# EasyEDA Pro project 第十五届蓝桥杯EDA赛项模拟试题一（嘉立创EDA提供）.eprj

# Schematic Schematic1
Board Name: Board1; Create Date: 2024-01-25; Page Name: P1; Project Name: 第十五届蓝桥杯EDA赛项模拟试题一（嘉立创EDA提供）; Schematic Name: Schematic1; Update Date: 2024-10-25; Company: 深圳嘉立创科技集团股份有限公司; Drawed: 嘉立创EDA; Page Size: A4; Part Number: JLC-PCB-002; Reviewed: 嘉立创EDA; Version: V1.0
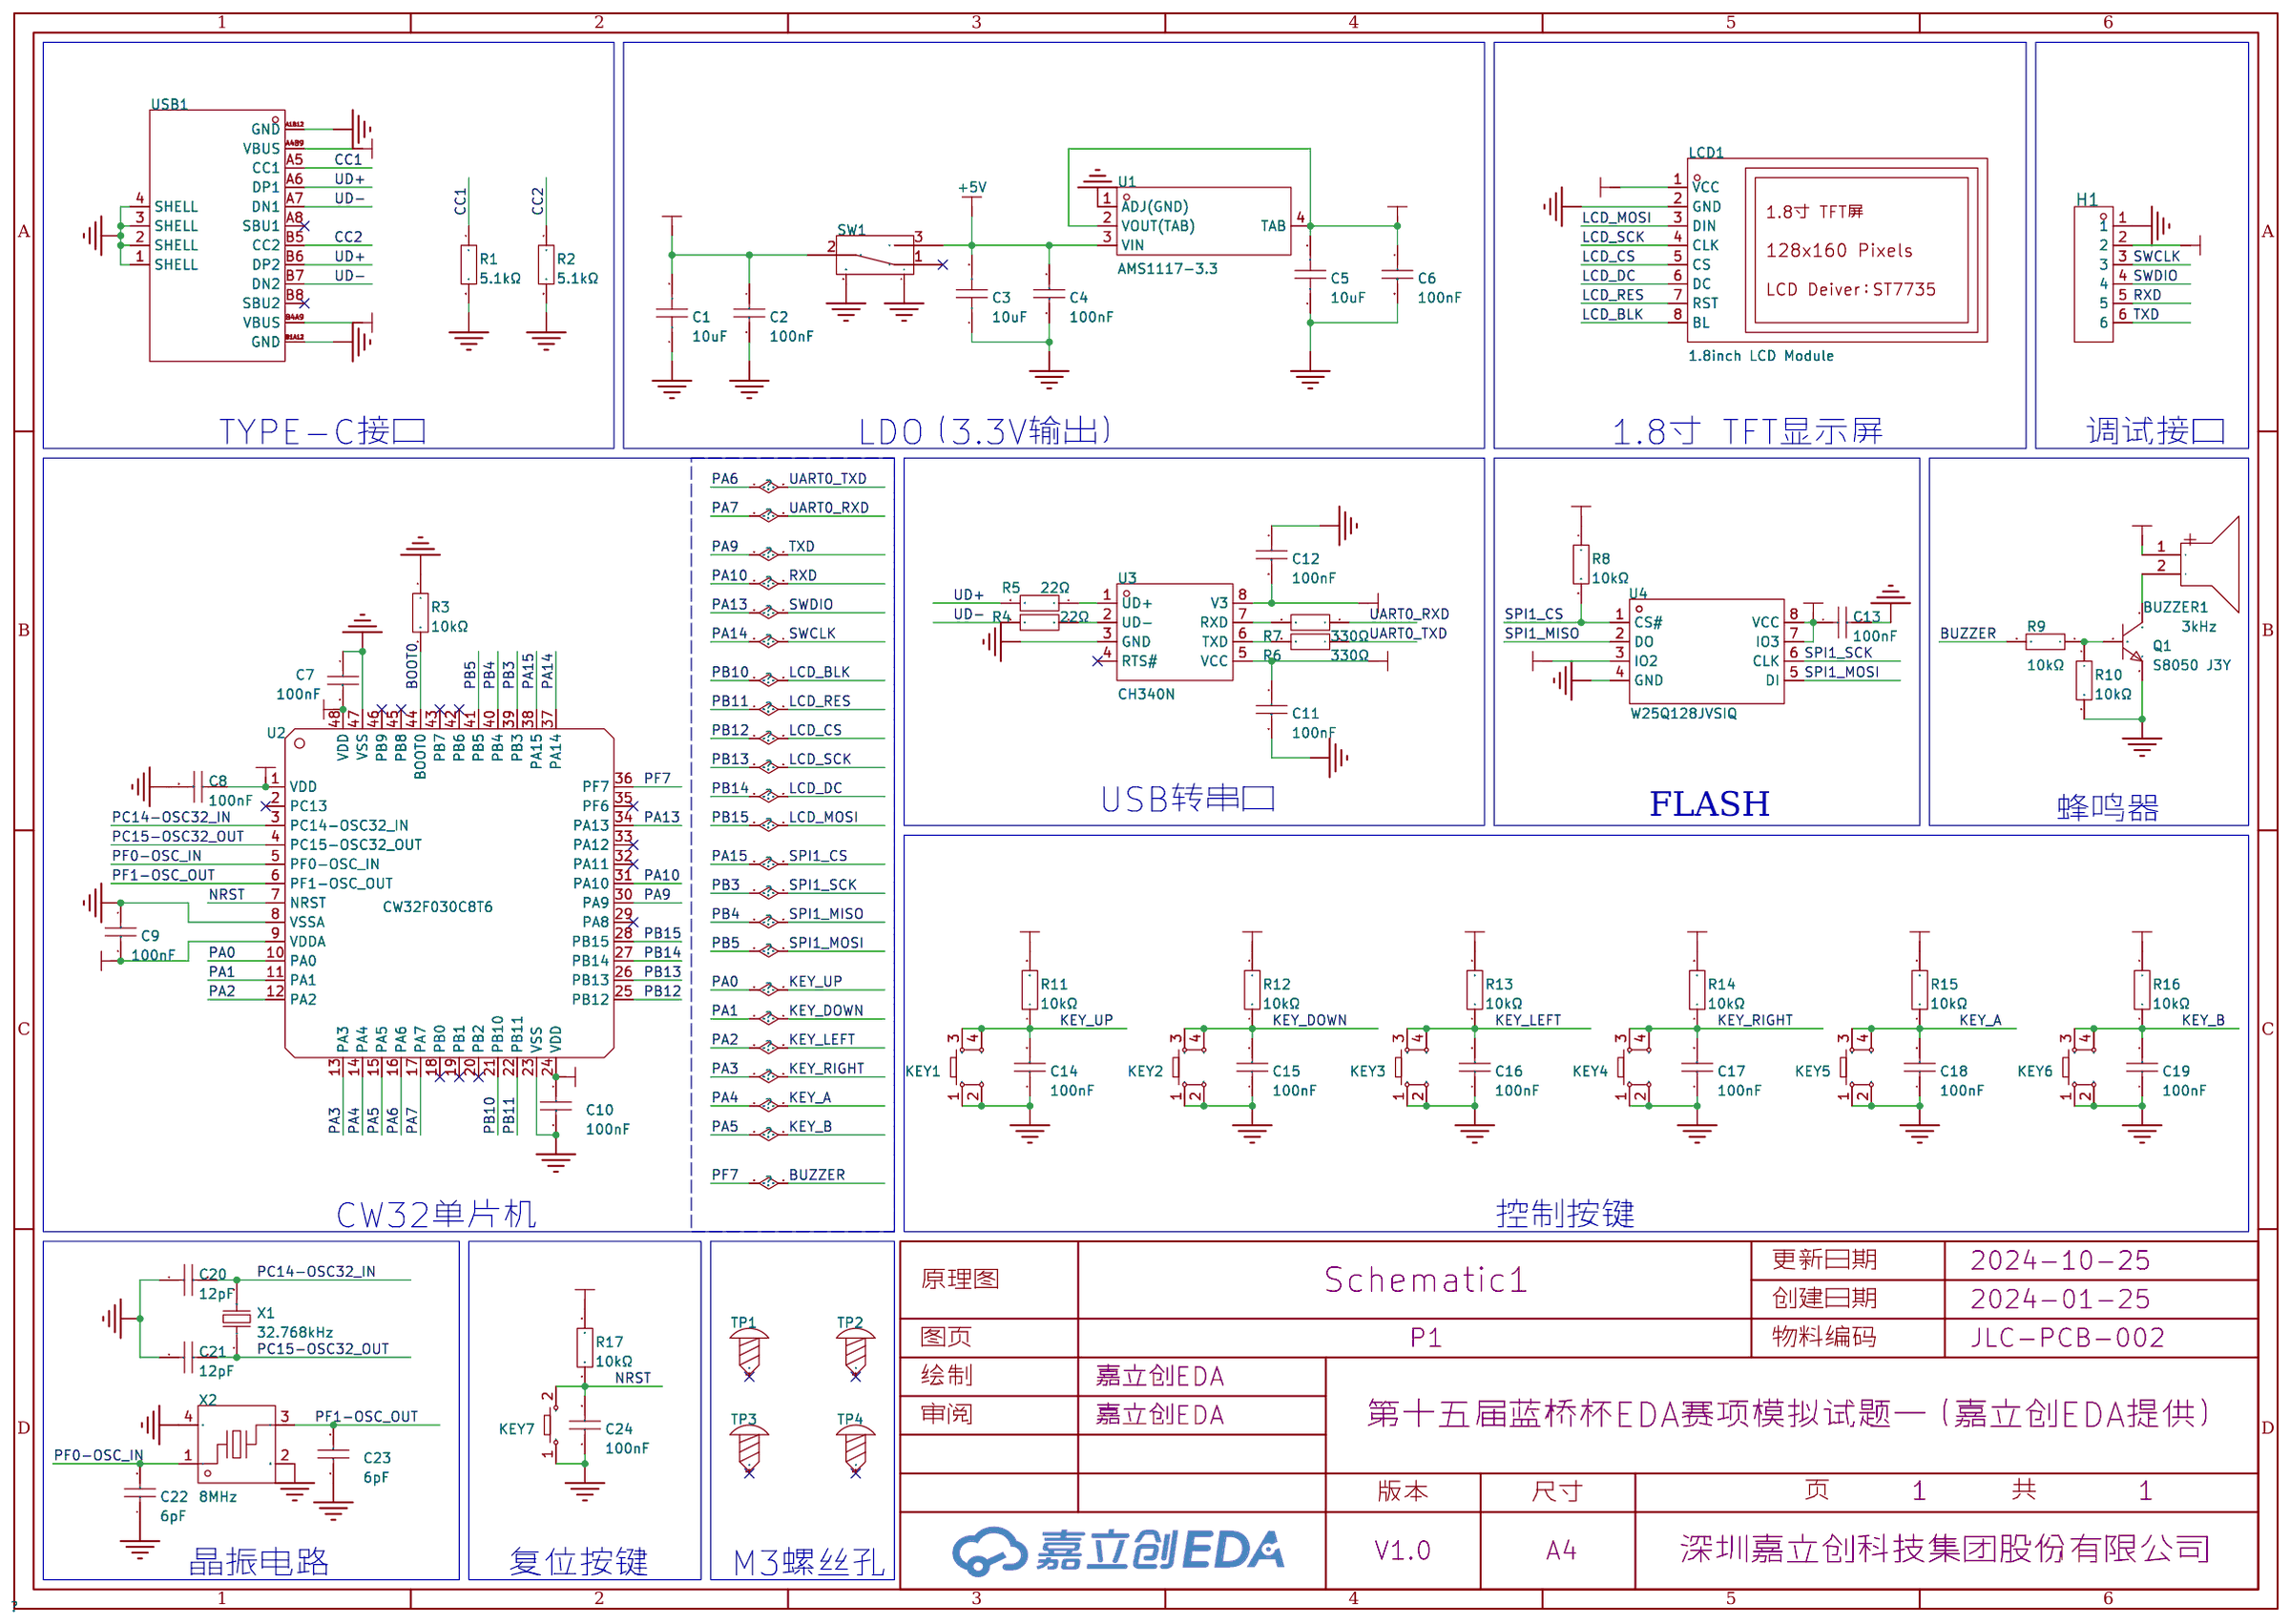
[diagram p0: schematic sheet]

## Parts
BUZZER1  3kHz  [BUZ-TH_BD9.0-P5.00-D0.6-FD]
C1  10uF  [C0805]
C2  100nF  [C0805]
C3  10uF  [C0805]
C4  100nF  [C0805]
C5  10uF  [C0805]
C6  100nF  [C0805]
C7  100nF  [C0805]
C8  100nF  [C0805]
C9  100nF  [C0805]
C10  100nF  [C0805]
C11  100nF  [C0805]
C12  100nF  [C0805]
C13  100nF  [C0805]
C14  100nF  [C0805]
C15  100nF  [C0805]
C16  100nF  [C0805]
C17  100nF  [C0805]
C18  100nF  [C0805]
C19  100nF  [C0805]
C20  12pF  [C0805]
C21  12pF  [C0805]
C22  6pF  [C0805]
C23  6pF  [C0805]
C24  100nF  [C0805]
H1  PZ254V-11-06P  [HDR-TH_6P-P2.54-V-M]
KEY1  -  [SW-SMD_4P-L6.0-W6.0-P4.50-LS9.0-2]
KEY2  -  [SW-SMD_4P-L6.0-W6.0-P4.50-LS9.0-2]
KEY3  -  [SW-SMD_4P-L6.0-W6.0-P4.50-LS9.0-2]
KEY4  -  [SW-SMD_4P-L6.0-W6.0-P4.50-LS9.0-2]
KEY5  -  [SW-SMD_4P-L6.0-W6.0-P4.50-LS9.0-2]
KEY6  -  [SW-SMD_4P-L6.0-W6.0-P4.50-LS9.0-2]
KEY7  -  [Key_SMD_3.6x6.1x2.5]
LCD1  1.8inch LCD Module  [LCD-TH_L56.5-W34.0_1-8INCH-LCD-MODULE]
Q1  S8050 J3Y  [SOT-23-3_L3.0-W1.7-P0.95-LS2.9-BR]
R1  5.1kΩ  [R0805]
R2  5.1kΩ  [R0805]
R3  10kΩ  [R0805]
R4  22Ω  [R0805]
R5  22Ω  [R0805]
R6  330Ω  [R0805]
R7  330Ω  [R0805]
R8  10kΩ  [R0805]
R9  10kΩ  [R0805]
R10  10kΩ  [R0805]
R11  10kΩ  [R0805]
R12  10kΩ  [R0805]
R13  10kΩ  [R0805]
R14  10kΩ  [R0805]
R15  10kΩ  [R0805]
R16  10kΩ  [R0805]
R17  10kΩ  [R0805]
SW1  SK-12E12-G5  [SW-TH_SK-12E12-G5]
TP1  -  [M3螺丝]
TP2  -  [M3螺丝]
TP3  -  [M3螺丝]
TP4  -  [M3螺丝]
U1  AMS1117-3.3  [SOT-223-4_L6.5-W3.5-P2.30-LS7.0-BR]
U2  CW32F030C8T6  [LQ-LQFP48]
U3  CH340N  [sop-8_l4.9-w3.9-p1.27-ls6.0-bl]
U4  W25Q128JVSIQ  [SOIC-8_L5.3-W5.3-P1.27-LS8.0-BL]
USB1  TYPE-C 16PIN 3MD(385)  [USB-C-SMD_TYPE-C16PIN]
X1  32.768kHz  [fc-135r_l3.2-w1.5]
X2  8MHz  [OSC-SMD_4P-L3.2-W2.5-BL]

## Library data of the parts
BUZZER1 = HNB09A03: 驱动方式:有源(内含驱动线路);构造类型:电磁式;额定电压:3V;工作电压:1.5V~4.5V;消耗电流:30mA;频率:3kHz;声压(SPL):85dB@10cm;直径(φD):9mm;长度:-;宽度:-;高度:5.5mm;工作温度:-20℃~+70℃;; LCSC Part Name: 电磁式有源一体蜂鸣器HNB09A03; Supplier Part: C96102; Manufacturer: 华能; Supplier Footprint: 插件,D=9mm; Datasheet: https://atta.szlcsc.com/upload/public/pdf/source/20170522/1495448326172.pdf; Supplier: LCSC; Oscillator Circuit: 有源(内含驱动线路); Technology Type: 电磁式; Rated Voltage: 3V; Operating Voltage: 1.5V~4.5V; Current Consumption: 30mA; Sound Pressure Level (SPL): 85dB@10cm; Diameter (φD): 9mm; Height: 5.5mm; Operating Temperature: -20℃~+70℃
C1 C3 C5 = CL21A106KAYNNNE_C15850: 容值:10uF;精度:±10%;额定电压:25V;材质(温度系数):X5R;; LCSC Part Name: 10uF ±10% 25V; Supplier Part: C15850; Manufacturer: SAMSUNG(三星); Manufacturer Part: CL21A106KAYNNNE; Supplier Footprint: 0805; Datasheet: https://atta.szlcsc.com/upload/public/pdf/source/20160103/1457707679302.pdf; Supplier: LCSC; Tolerance: ±10%; Voltage Rated: 25V; Temperature Coefficient: X5R
C2 C4 C6-C19 C24 = CL21B104KBCNNNC: 容值:100nF;精度:±10%;额定电压:50V;材质(温度系数):X7R;; LCSC Part Name: 100nF ±10% 50V; Supplier Part: C1711; Manufacturer: SAMSUNG(三星); Supplier Footprint: 0805; Datasheet: https://atta.szlcsc.com/upload/public/pdf/source/20160218/1457707763339.pdf; Supplier: LCSC; Tolerance: ±10%; Voltage Rated: 50V; Temperature Coefficient: X7R
C20 C21 = 0805CG120J500NT: 容值:12pF;精度:±5%;额定电压:50V;材质(温度系数):C0G;; LCSC Part Name: 12pF ±5% 50V; Supplier Part: C1792; Manufacturer: FH(风华); Supplier Footprint: 0805; Datasheet: https://atta.szlcsc.com/upload/public/pdf/source/20200305/C486355_26A10D38EF8C2A5C37091D0039909270.pdf; Supplier: LCSC; Tolerance: ±5%; Voltage Rated: 50V; Temperature Coefficient: C0G
C22 C23 = 0805CG6R0C500NT: 容值:6pF;额定电压:50V;材质(温度系数):C0G;; LCSC Part Name: 6pF 50V ±0.25pF; Supplier Part: C67560; Manufacturer: FH(风华); Supplier Footprint: 0805; JLCPCB Part Class: 扩展库; Datasheet: https://atta.szlcsc.com/upload/public/pdf/source/20200305/C486355_26A10D38EF8C2A5C37091D0039909270.pdf; Supplier: LCSC; Voltage Rated: 50V; Temperature Coefficient: C0G
H1 = PZ254V-11-06P: 排数:单排;总PIN位数:6;间距:2.54mm;插针结构:1x6P;行距:-;安装类型:直插;圆针/方针:方针;额定电流:-;额定电压:-;配合针长度:6mm;塑高:2.5mm;端接针长度:3mm;触头材质:黄铜;触头镀层:-;工作温度范围:-40℃~+105℃;颜色:黑色;; LCSC Part Name: 2.54mm 1x6P 直插 方针; Supplier Part: C492405; Manufacturer: XFCN(兴飞); Supplier Footprint: 直插,P=2.54mm; JLCPCB Part Class: 扩展库; Supplier: LCSC; Number of Rows: 单排; Number of Pins: 6; Pitch: 2.54mm; Pin Structure: 1x6P; Mounting Type: 直插; Circluar Pins/Square Pins: 方针; Length of Mating Pin: 6mm; Insulation Height: 2.5mm; Length of End Connection Pin: 3mm; Contact Material: 黄铜; Operating Temperature Range: -40℃~+105℃; Color: 黑色
KEY1-KEY6 = Key_SMD_6x6x6.5: Supplier Footprint: SMD
KEY7 = Key_SMD_3.6x6.1x2.5: Supplier Footprint: SMD
LCD1 = 1.8inch LCD Module: 主控芯片:ST7735S;尺寸(inch):1.8;; LCSC Part Name: 树莓派 1.8寸LCD 迷你显示屏 扩展板 SPI接口 支持Arduino; Supplier Part: C359940; Manufacturer: Waveshare(微雪电子); Datasheet: https://atta.szlcsc.com/upload/public/pdf/source/20190107/C359940_B08D95A5D16FFF3D67403C4EC320696B.pdf; Supplier: LCSC; Main Control Chip: ST7735S; Size: 1.8
Q1 = S8050 J3Y_C2146: 晶体管类型:NPN;集射极击穿电压(Vceo):25V;集电极电流(Ic):500mA;功率(Pd):300mW;直流电流增益(hFE@Ic,Vce):200@50mA,1V;; LCSC Part Name: NPN 25V 500mA (200-350); Supplier Part: C2146; Manufacturer: CJ(江苏长电/长晶); Supplier Footprint: SOT-23; Datasheet: https://atta.szlcsc.com/upload/public/pdf/source/20140809/1457707209234.pdf; Supplier: LCSC; Transistor Type: NPN; Collector-Emitter Breakdown Voltage (Vceo): 25V; Collector Current (Ic): 500mA; Power Dissipation (Pd): 300mW; Collector Cut-Off Current (Icbo): 100nA; Collector-Emitter Saturation Voltage (VCE(sat)@Ic,Ib): 600mV@500mA,50mA; DC Current Gain (hFE@Ic,Vce): 200@50mA,1V; Transition Frequency (fT): 150MHz; Operating Temperature: +150℃@(Tj)
R1 R2 = 0805W8F5101T5E: 阻值:5.1kΩ;精度:±1%;功率:125mW;温度系数:±100ppm/℃;电阻类型:厚膜电阻;; LCSC Part Name: 5.1kΩ ±1% 125mW 厚膜电阻; Supplier Part: C27834; Manufacturer: UNI-ROYAL(厚声); Supplier Footprint: 0805; JLCPCB Part Class: 基础库; Datasheet: https://atta.szlcsc.com/upload/public/pdf/source/20200306/C422600_1E6D84923E4A46A82E41ADD87F860B5C.pdf; Supplier: LCSC; Tolerance: ±1%; Power(Watts): 125mW; Overload Voltage (Max): 150V; Temperature Coefficient: ±100ppm/℃; Type: 厚膜电阻; Operating Temperature Range: -55℃~+155℃
R3 R8-R17 = 0805W8F1002T5E_C17414: 阻值:10kΩ;精度:±1%;功率:125mW;温度系数:±100ppm/℃;电阻类型:厚膜电阻;; LCSC Part Name: 10kΩ ±1% 125mW 厚膜电阻; Supplier Part: C17414; Manufacturer: UNI-ROYAL(厚声); Manufacturer Part: 0805W8F1002T5E; Supplier Footprint: 0805; Datasheet: https://atta.szlcsc.com/upload/public/pdf/source/20200306/C422600_1E6D84923E4A46A82E41ADD87F860B5C.pdf; Supplier: LCSC; Tolerance: ±1%; Power(Watts): 125mW; Overload Voltage (Max): 150V; Temperature Coefficient: ±100ppm/℃; Type: 厚膜电阻; Operating Temperature Range: -55℃~+155℃
R4 R5 = 0805W8F220JT5E: 阻值:22Ω;精度:±1%;功率:125mW;温度系数:±100ppm/℃;电阻类型:厚膜电阻;; LCSC Part Name: 22Ω ±1% 125mW 厚膜电阻; Supplier Part: C17561; Manufacturer: UNI-ROYAL(厚声); Supplier Footprint: 0805; JLCPCB Part Class: 基础库; Datasheet: https://atta.szlcsc.com/upload/public/pdf/source/20200306/C422600_1E6D84923E4A46A82E41ADD87F860B5C.pdf; Supplier: LCSC; Tolerance: ±1%; Power(Watts): 125mW; Overload Voltage (Max): 150V; Temperature Coefficient: ±100ppm/℃; Type: 厚膜电阻; Operating Temperature Range: -55℃~+155℃
R6 R7 = 0805W8F3300T5E: 阻值:330Ω;精度:±1%;功率:125mW;温度系数:±100ppm/℃;电阻类型:厚膜电阻;; LCSC Part Name: 330Ω ±1% 125mW 厚膜电阻; Supplier Part: C17630; Manufacturer: UNI-ROYAL(厚声); Supplier Footprint: 0805; JLCPCB Part Class: 基础库; Datasheet: https://atta.szlcsc.com/upload/public/pdf/source/20200306/C422600_1E6D84923E4A46A82E41ADD87F860B5C.pdf; Supplier: LCSC; Tolerance: ±1%; Power(Watts): 125mW; Overload Voltage (Max): 150V; Temperature Coefficient: ±100ppm/℃; Type: 厚膜电阻; Operating Temperature Range: -55℃~+155℃
SW1 = SK-12E12-G5: 额定电流(DC):-;额定电压(DC):-;额定电流(AC):-;额定电压(AC):-;电路结构:单刀双掷;安装方式:卧插;机械寿命:5千次;; LCSC Part Name: 卧插双档 滑动开关; Supplier Part: C136720; Manufacturer: 韩国韩荣; Supplier Footprint: 插件; JLCPCB Part Class: 扩展库; Datasheet: https://atta.szlcsc.com/upload/public/pdf/source/20210810/880D64C2F8CCE477762EFCC00B7B7681.pdf; Supplier: LCSC; Circuit: 单刀双掷; Mounting Style: 卧插; Mechanical Life: 5千次; Actuator Style: 矩形柱状; Pin Style: PC引脚; Operating Temperature: -25℃~+70℃; Switch Height: 10.6mm
TP1-TP4 = M3螺丝: Supplier Footprint: 插件
U1 = AMS1117-3.3_C347222: 输出类型:固定;最大输入电压:18V;输出电压:3.3V;输出电流:1A;电源纹波抑制比(PSRR):60dB@(120Hz);输出极性:正;; LCSC Part Name: 输入18V 输出3.3V 1A; Supplier Part: C347222; Manufacturer: UMW(友台半导体); Supplier Footprint: SOT-223; JLCPCB Part Class: 扩展库; Datasheet: https://atta.szlcsc.com/upload/public/pdf/source/20231109/155D79A26D9DB04352555A58D5969DC8.pdf; Supplier: LCSC; Output Type: 固定; Maximum Input Voltage: 18V; Output Voltage: 3.3V; Output Current: 1A; Power Supply Rejection Ratio (PSRR): 60dB@(120Hz); Dropout Voltage: 1.3V@(1A); Output Polarity: 正; Number of Outputs: 1
U2 = CW32F030C8T6_C3019113: CPU内核:ARM-M系列;CPU最大主频:64MHz;程序存储容量:-;程序存储器类型:-;GPIO端口数量:39;工作电压范围:1.65V~5.5V;RAM总容量:8KB;; Supplier Part: C3019113; Manufacturer: CW(芯源); Supplier Footprint: LQFP-48(7x7); Datasheet: https://atta.szlcsc.com/upload/public/pdf/source/20220516/D60F5E1023A73FFF550D4A77416DDFBC.pdf; Supplier: LCSC; CPU Core: ARM-M系列; CPU Maximum Speed: 64MHz; GPIO Ports Number: 39; Operating Voltage Range: 1.65V~5.5V; RAM Size: 8KB; Operating Temperature Range: -40℃~+105℃; ADC (Bit): 12bit; 16Bit Timer: 8; UART/USART: 3; I2C: 2; SPI: 2; Internal Comparator: 有; Peripheral/Function: 片载温度传感器；DMA；看门狗；低电压检测；CRC校验; Watchdog: 有; Low-Voltage Detect: 有; Direct Memory Access: 有
U3 = CH340N: LCSC Part Name: USB转串口芯片 CH340; Supplier Part: C2977777; Manufacturer: WCH(南京沁恒); Supplier Footprint: SOP-8; JLCPCB Part Class: 扩展库; Datasheet: https://atta.szlcsc.com/upload/public/pdf/source/20230530/6E401E9554E9F5311886CC8B3F89B62E.pdf; Supplier: LCSC
U4 = W25Q128JVSIQ: 接口类型:-;存储容量:128Mbit;时钟频率(fc):-;; LCSC Part Name: W25Q128JVSIQ 编带; Supplier Part: C97521; Manufacturer: WINBOND(华邦); Supplier Footprint: SOP-8-208mil; JLCPCB Part Class: 基础库; Datasheet: https://atta.szlcsc.com/upload/public/pdf/source/20170316/1489627409956.pdf; Supplier: LCSC; Memory Size: 128Mbit
USB1 = TYPE-C 16PIN 3MD(385): 连接器类型:Type-C;标准:-;公母:母;端口数量:1;触点数量:16P;安装方式:卧贴;额定电流 - 电源:3A;工作温度范围:-40℃~+85℃;; LCSC Part Name: Type-C 母 卧贴; Supplier Part: C2858270; Manufacturer: SHOU HAN(首韩); Supplier Footprint: SMD; JLCPCB Part Class: Extended Part; Datasheet: https://atta.szlcsc.com/upload/public/pdf/source/20211123/39B17C16241EAC15C5E277BDA434118E.pdf; Supplier: LCSC; Connector Type: Type-C; Gender: 母; Number of Ports: 1; Number of Contacts: 16P; Mounting Style: 卧贴; Current Rating - Power (Max): 3A; Operating Temperature Range: -40℃~+85℃
X1 = Q13FC1350000400: 频率:32.768kHz;负载电容:12.5pF;频率公差:±20ppm;; LCSC Part Name: 32.768kHz ±20ppm 12.5pF; Supplier Part: C32346; Manufacturer: EPSON(爱普生); Supplier Footprint: SMD3215-2P; Datasheet: https://atta.szlcsc.com/upload/public/pdf/source/20190108/C32346_746D6B07EAF90824457A96480007685F.pdf; Supplier: LCSC; Crystal Type: 贴片无源晶振; Load Capacitance: 12.5pF; Equivalent Series Resistance (ESR): 70kΩ; Frequency Tolerance: ±20ppm; Operating Temperature: -40℃~+85℃
X2 = X32258MOB4SI: 晶振类型:贴片无源晶振;频率:8MHz;常温频差:±10ppm;负载电容:12pF;频率稳定度(全温):±30ppm;; LCSC Part Name: 8MHz ±10ppm 12pF; Supplier Part: C2682775; Manufacturer: YXC(扬兴晶振); Supplier Footprint: SMD3225-4P; JLCPCB Part Class: 扩展库; Datasheet: https://atta.szlcsc.com/upload/public/pdf/source/20210106/C2682774_0CD4FDA5D9DA3FBEEC23BD607A48E4B0.pdf; Supplier: LCSC; Crystal Type: 贴片无源晶振; Normal temperature Frequency Tolerance: ±10ppm; Load Capacitance: 12pF; Frequency Stability(Full temperature range): ±30ppm; Equivalent Series Resistance (ESR): 150Ω; Operating Temperature: -40℃~+85℃

## Nets
3V3: BUZZER1.1(+) C5.2 C6.1 C7.2 C8.1 C9.2 C10.1 C11.1 C12.2 C13.1 H1.2 LCD1.1(VCC) R8.1 R11.2 R12.2 R13.2 R14.2 R15.2 R16.2 R17.2 U1.2(VOUT(TAB)) U1.4(TAB) U2.1(VDD) U2.9(VDDA) U2.24(VDD) U2.48(VDD) U3.5(VCC) U3.8(V3) U4.3(IO2) U4.7(IO3) U4.8(VCC)
+5V: C3.2 C4.1 SW1.3 U1.3(VIN)
GND: C1.1 C2.2 C3.1 C4.2 C5.1 C6.2 C7.1 C8.2 C9.1 C10.2 C11.2 C12.1 C13.2 C14.1 C15.1 C16.1 C17.1 C18.1 C19.1 C20.1 C21.1 C22.1 C23.1 C24.1 H1.1 KEY1.1 KEY1.2 KEY2.1 KEY2.2 KEY3.1 KEY3.2 KEY4.1 KEY4.2 KEY5.1 KEY5.2 KEY6.1 KEY6.2 KEY7.1 LCD1.2(GND) Q1.2(E) R1.2 R2.2 R3.1 R10.2 SW1.4 SW1.5 U1.1(ADJ(GND)) U2.8(VSSA) U2.23(VSS) U2.47(VSS) U3.3(GND) U4.4(GND) USB1.1(SHELL) USB1.2(SHELL) USB1.3(SHELL) USB1.4(SHELL) USB1.A1B12(GND) USB1.B1A12(GND) X2.2(GND) X2.4(GND)
VBUS: C1.2 C2.1 SW1.2 USB1.A4B9(VBUS) USB1.B4A9(VBUS)
BOOT0: R3.2 U2.44(BOOT0)
BUZZER: R9.2 U2.36(PF7)
CC1: R1.1 USB1.A5(CC1)
CC2: R2.1 USB1.B5(CC2)
KEY_A: C18.2 KEY5.3 KEY5.4 R15.1 U2.14(PA4)
KEY_B: C19.2 KEY6.3 KEY6.4 R16.1 U2.15(PA5)
KEY_DOWN: C15.2 KEY2.3 KEY2.4 R12.1 U2.11(PA1)
KEY_LEFT: C16.2 KEY3.3 KEY3.4 R13.1 U2.12(PA2)
KEY_RIGHT: C17.2 KEY4.3 KEY4.4 R14.1 U2.13(PA3)
KEY_UP: C14.2 KEY1.3 KEY1.4 R11.1 U2.10(PA0)
LCD_BLK: LCD1.8(BL) U2.21(PB10)
LCD_CS: LCD1.5(CS) U2.25(PB12)
LCD_DC: LCD1.6(DC) U2.27(PB14)
LCD_MOSI: LCD1.3(DIN) U2.28(PB15)
LCD_RES: LCD1.7(RST) U2.22(PB11)
LCD_SCK: LCD1.4(CLK) U2.26(PB13)
NRST: C24.2 KEY7.2 R17.1 U2.7(NRST)
PA6: R6.1 U2.16(PA6)
PA7: R7.1 U2.17(PA7)
PA9: H1.6 U2.30(PA9)
PA10: H1.5 U2.31(PA10)
PA13: H1.4 U2.34(PA13)
PA14: H1.3 U2.37(PA14)
PA15: R8.2 U2.38(PA15) U4.1(CS#)
PB3: U2.39(PB3) U4.6(CLK)
PB4: U2.40(PB4) U4.2(DO)
PB5: U2.41(PB5) U4.5(DI)
PC14-OSC32_IN: C20.2 U2.3(PC14-OSC32_IN) X1.2
PC15-OSC32_OUT: C21.2 U2.4(PC15-OSC32_OUT) X1.1
PF0-OSC_IN: C22.2 U2.5(PF0-OSC_IN) X2.1
PF1-OSC_OUT: C23.2 U2.6(PF1-OSC_OUT) X2.3
UD+: R5.2 USB1.A6(DP1) USB1.B6(DP2)
UD-: R4.2 USB1.A7(DN1) USB1.B7(DN2)
$1N8057: Q1.1(B) R9.1 R10.1
$1N8058: BUZZER1.2(-) Q1.3(C)
$1N34821: R5.1 U3.1(UD+)
$1N34825: R4.1 U3.2(UD-)
$1N34844: R7.2 U3.7(RXD)
$1N34851: R6.2 U3.6(TXD)

Not connected (* = marked no-connect by the designer): SW1 1*; TP1 1*; TP2 1*; TP3 1*; TP4 1*; U2 2(PC13)* 18(PB0)* 19(PB1)* 20(PB2)* 29(PA8)* 32(PA11)* 33(PA12)* 35(PF6)* 42(PB6)* 43(PB7)* 45(PB8)* 46(PB9)*; U3 4(RTS#)*; USB1 A8(SBU1)* B8(SBU2)*

## Notes on the sheet
- TYPE-C接口
- LDO（3.3V输出）
- 1.8寸 TFT显示屏
- 调试接口
- USB转串口
- FLASH
- 蜂鸣器
- CW32单片机
- 控制按键
- 晶振电路
- 复位按键
- M3螺丝孔

# Board PCB1
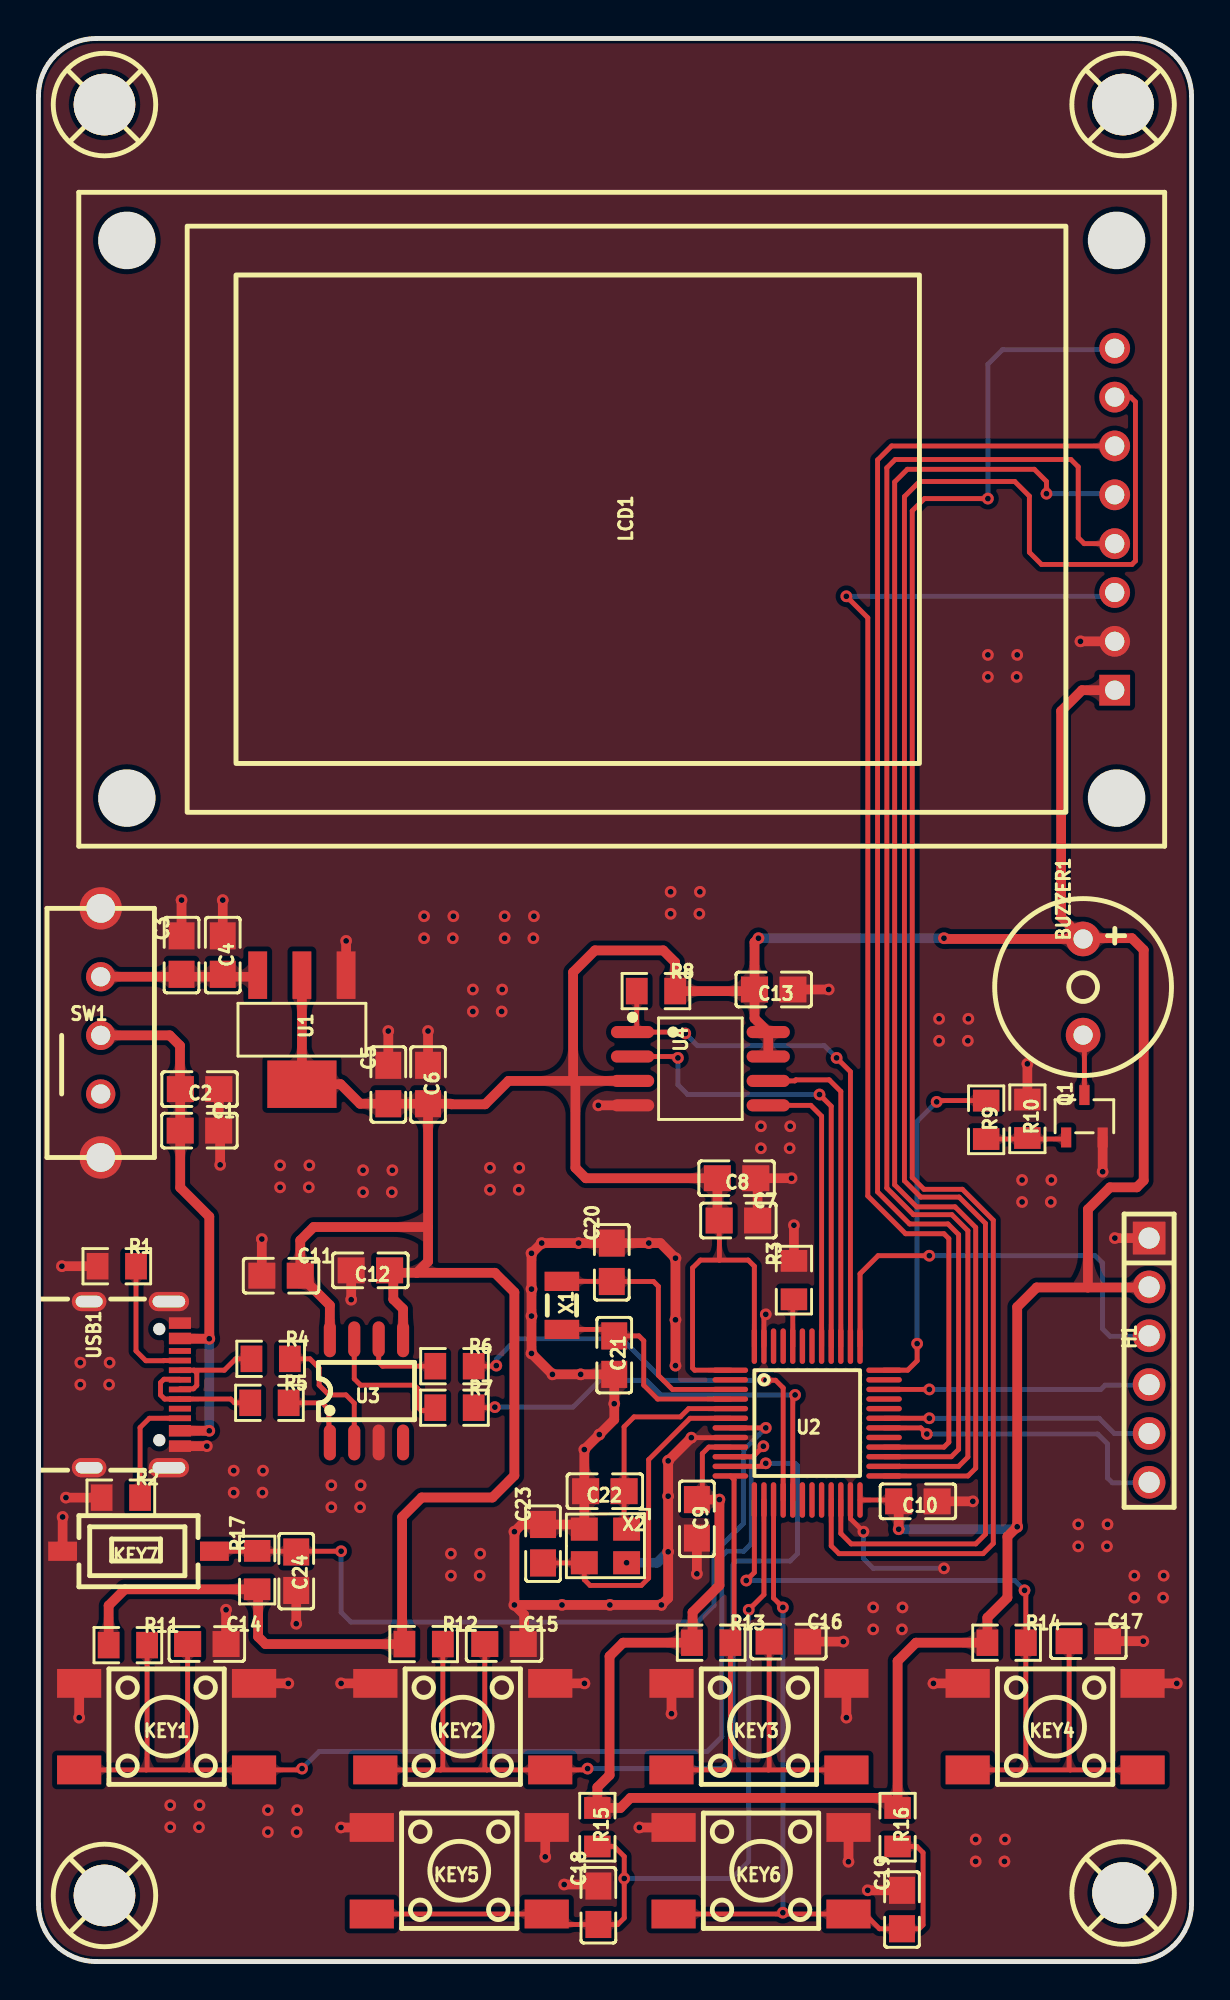
[diagram p1: board, top side]
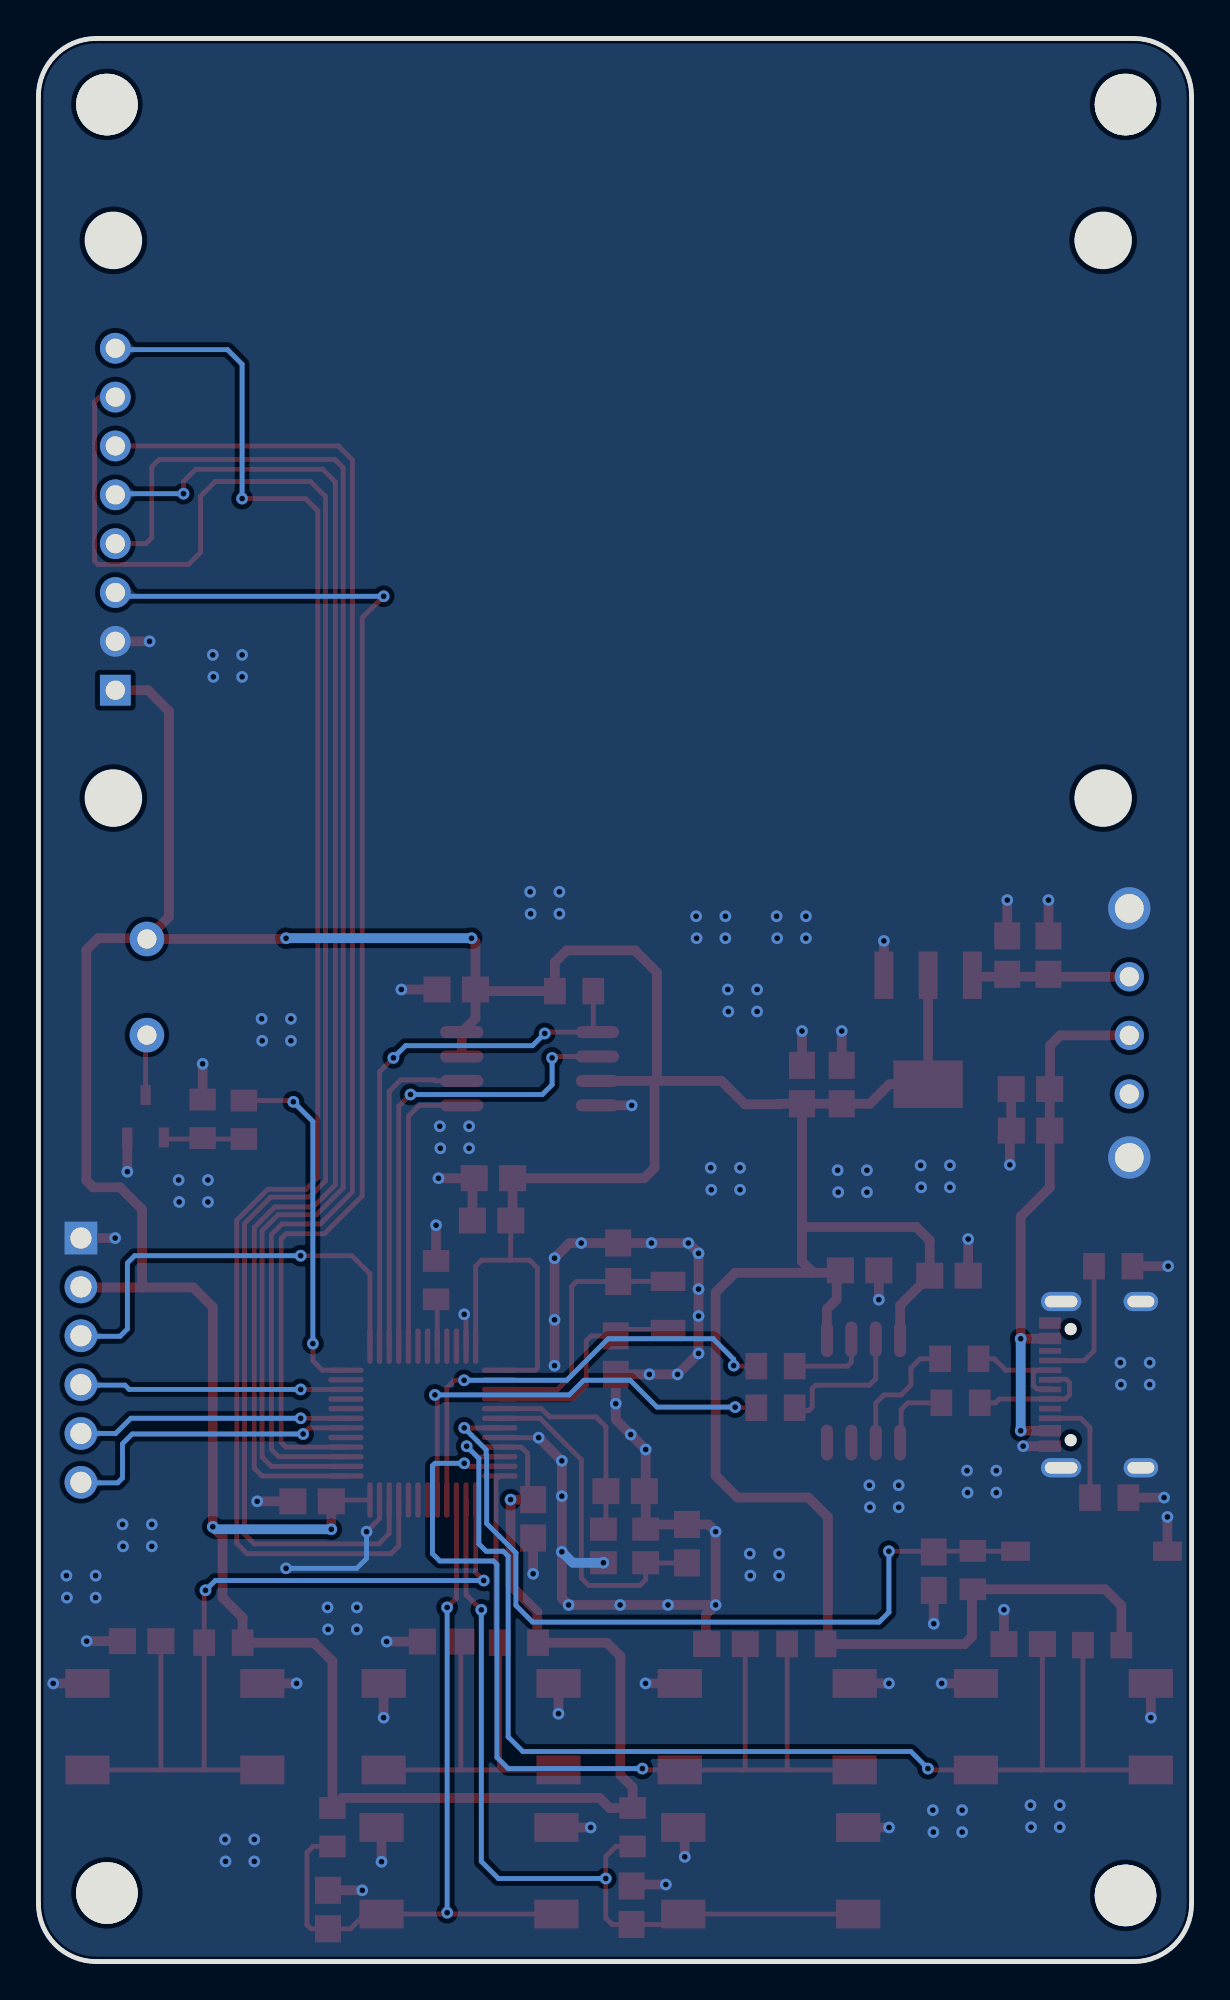
[diagram p2: board, bottom side, seen from below]

Outline 60 x 100 mm; copper layers: Top Layer, Bottom Layer. Coordinates in mm from the lower left corner of the outline.
Outline path: 0,97 0,3 arc(0.88,0.88) 3,0 57,0 arc(59.12,0.88) 60,3 60,97 arc(59.12,99.12) 57,100 3,100 arc(0.88,99.12) 0,97
Stack: Top Layer 0.035mm / Dielectric1 1.51mm FR4 er 4.5 / Bottom Layer 0.035mm

## Design rules (mm)
template: 自定义配置
spacing copperThickness1oz (default): track to track 0.152, other pairs 0.152 to 0.152
spacing copperThickness2oz: track to track 0.203, other pairs 0.152 to 0.3
track width copperThickness1oz (default): min 0.254, default 0.254, max 2.54
track width copperThickness2oz: min 0.203, default 0.254, max 2.54
differential pair differentialPair (default): width min 0.127, default 0.254, max 2.54; gap min 0.152, default 0.152
via viaSize (default): diameter min 0.559, default 0.559, max 10; hole min 0.254, default 0.254, max 6.299

## Placement (name value [footprint] x y rotation side)
BUZZER1  3kHz  [BUZ-TH_BD9.0-P5.00-D0.6-FD]  54.36 50.67 270 top
C1  10uF  [C0805]  8.38 43.21 180 top
C2  100nF  [C0805]  8.38 45.37 0 top
C3  10uF  [C0805]  7.45 52.34 270 top
C4  100nF  [C0805]  9.59 52.34 90 top
C5  10uF  [C0805]  18.2 45.61 270 top
C6  100nF  [C0805]  20.27 45.61 90 top
C7  100nF  [C0805]  36.42 38.53 180 top
C8  100nF  [C0805]  36.33 40.73 0 top
C9  100nF  [C0805]  34.26 23.02 90 top
C10  100nF  [C0805]  45.76 23.93 0 top
C11  100nF  [C0805]  12.62 35.66 180 top
C12  100nF  [C0805]  17.27 35.94 0 top
C13  100nF  [C0805]  38.26 50.55 0 top
C14  100nF  [C0805]  8.76 16.51 180 top
C15  100nF  [C0805]  24.22 16.51 180 top
C16  100nF  [C0805]  39.02 16.64 180 top
C17  100nF  [C0805]  54.63 16.66 180 top
C18  100nF  [C0805]  29.14 2.93 270 top
C19  100nF  [C0805]  44.93 2.71 270 top
C20  12pF  [C0805]  29.83 36.36 270 top
C21  12pF  [C0805]  29.96 31.53 90 top
C22  6pF  [C0805]  29.47 24.46 0 top
C23  6pF  [C0805]  26.25 21.73 270 top
C24  100nF  [C0805]  13.41 20.3 90 top
H1  PZ254V-11-06P  [HDR-TH_6P-P2.54-V-M]  57.79 31.27 270 top
KEY1  -  [SW-SMD_4P-L6.0-W6.0-P4.50-LS9.0-2]  6.67 12.21 0 top
KEY2  -  [SW-SMD_4P-L6.0-W6.0-P4.50-LS9.0-2]  22.08 12.21 0 top
KEY3  -  [SW-SMD_4P-L6.0-W6.0-P4.50-LS9.0-2]  37.49 12.21 0 top
KEY4  -  [SW-SMD_4P-L6.0-W6.0-P4.50-LS9.0-2]  52.9 12.21 0 top
KEY5  -  [SW-SMD_4P-L6.0-W6.0-P4.50-LS9.0-2]  21.9 4.72 0 top
KEY6  -  [SW-SMD_4P-L6.0-W6.0-P4.50-LS9.0-2]  37.6 4.72 0 top
KEY7  -  [Key_SMD_3.6x6.1x2.5]  5.21 21.34 0 top
LCD1  1.8inch LCD Module  [LCD-TH_L56.5-W34.0_1-8INCH-LCD-MODULE]  56 75 90 top
Q1  S8050 J3Y  [SOT-23-3_L3.0-W1.7-P0.95-LS2.9-BR]  54.42 43.95 270 top
R1  5.1kΩ  [R0805]  4.08 36.16 180 top
R2  5.1kΩ  [R0805]  4.29 24.12 180 top
R3  10kΩ  [R0805]  39.31 35.43 270 top
R4  22Ω  [R0805]  12.08 31.34 180 top
R5  22Ω  [R0805]  12.02 29.05 180 top
R6  330Ω  [R0805]  21.65 30.96 180 top
R7  330Ω  [R0805]  21.65 28.8 180 top
R8  10kΩ  [R0805]  32.13 50.46 180 top
R9  10kΩ  [R0805]  49.31 43.77 90 top
R10  10kΩ  [R0805]  51.46 43.82 90 top
R11  10kΩ  [R0805]  4.65 16.45 180 top
R12  10kΩ  [R0805]  20.04 16.51 180 top
R13  10kΩ  [R0805]  35 16.58 180 top
R14  10kΩ  [R0805]  50.38 16.58 180 top
R15  10kΩ  [R0805]  29.08 6.99 90 top
R16  10kΩ  [R0805]  44.7 6.99 90 top
R17  10kΩ  [R0805]  11.38 20.36 270 top
SW1  SK-12E12-G5  [SW-TH_SK-12E12-G5]  3.24 48.29 180 top
TP1  -  [M3螺丝]  3.5 3.5 90 top
TP2  -  [M3螺丝]  3.5 96.5 0 top
TP3  -  [M3螺丝]  56.5 96.5 0 top
TP4  -  [M3螺丝]  56.5 3.5 0 top
U1  AMS1117-3.3  [SOT-223-4_L6.5-W3.5-P2.30-LS7.0-BR]  13.71 48.46 90 top
U2  CW32F030C8T6  [LQ-LQFP48]  40 28 0 top
U3  CH340N  [sop-8_l4.9-w3.9-p1.27-ls6.0-bl]  17.07 29.67 0 top
U4  W25Q128JVSIQ  [SOIC-8_L5.3-W5.3-P1.27-LS8.0-BL]  34.44 46.43 270 top
USB1  TYPE-C 16PIN 3MD(385)  [USB-C-SMD_TYPE-C16PIN]  5 30 270 top
X1  32.768kHz  [fc-135r_l3.2-w1.5]  27.24 34.12 90 top
X2  8MHz  [OSC-SMD_4P-L3.2-W2.5-BL]  29.5 21.61 180 top

## Footprints (pads in the part's own frame, mm; a bottom-side part is the same pattern mirrored in y, then rotated)
BUZ-TH_BD9.0-P5.00-D0.6-FD
  round 1.8 hole 1: 1(-2.5,0) 2(2.5,0)
C0805
  rect 1.41x1.35 smd: 1(-1,0) 2(1,0)
fc-135r_l3.2-w1.5
  rect 1x1.8 smd: 1(-1.25,0) 2(1.25,0)
HDR-TH_6P-P2.54-V-M
  rect 1.7x1.7 hole 1.1: 1(-6.35,0)
  round 1.7 hole 1.1: 2(-3.81,0) 3(-1.27,0) 4(1.27,0) 5(3.81,0) 6(6.35,0)
Key_SMD_3.6x6.1x2.5
  rect 1.501x1.001 smd: 1(-3.95,0) 2(3.95,0)
LCD-TH_L56.5-W34.0_1-8INCH-LCD-MODULE
  rect 1.6x1.6 hole 1: 1(-8.89,0)
  round 1.6 hole 1: 2(-6.35,0) 3(-3.81,0) 4(-1.27,0) 5(1.27,0) 6(3.81,0) 7(6.35,0) 8(8.89,0)
LQ-LQFP48
  oval 1.85x0.28 smd: 1(-4,2.75) 2(-4,2.25) 3(-4,1.75) 4(-4,1.25) 5(-4,0.75) 6(-4,0.25) 7(-4,-0.25) 8(-4,-0.75) 9(-4,-1.25) 10(-4,-1.75) 11(-4,-2.25) 12(-4,-2.75) 25(4,-2.75) 26(4,-2.25) 27(4,-1.75) 28(4,-1.25) 29(4,-0.75) 30(4,-0.25) 31(4,0.25) 32(4,0.75) 33(4,1.25) 34(4,1.75) 35(4,2.25) 36(4,2.75)
  oval 0.28x1.85 smd: 13(-2.75,-4) 14(-2.25,-4) 15(-1.75,-4) 16(-1.25,-4) 17(-0.75,-4) 18(-0.25,-4) 19(0.25,-4) 20(0.75,-4) 21(1.25,-4) 22(1.75,-4) 23(2.25,-4) 24(2.75,-4) 37(2.75,4) 38(2.25,4) 39(1.75,4) 40(1.25,4) 41(0.75,4) 42(0.25,4) 43(-0.25,4) 44(-0.75,4) 45(-1.25,4) 46(-1.75,4) 47(-2.25,4) 48(-2.75,4)
M3螺丝
  round 3.2 hole 3.2: 1(-0.064,0.064)
OSC-SMD_4P-L3.2-W2.5-BL
  rect 1.4x1.2 smd: 1(-1.1,-0.875) 2(1.1,-0.875) 3(1.1,0.875) 4(-1.1,0.875)
R0805
  rect 1.133x1.377 smd: 1(-1,0) 2(1,0)
SOIC-8_L5.3-W5.3-P1.27-LS8.0-BL
  oval 0.63x2.25 smd: 1(-1.905,-3.53) 2(-0.635,-3.53) 3(0.635,-3.53) 4(1.905,-3.53) 5(1.905,3.53) 6(0.635,3.53) 7(-0.635,3.53) 8(-1.905,3.53)
sop-8_l4.9-w3.9-p1.27-ls6.0-bl
  oval 0.63x1.865 smd: 1(-1.905,-2.683) 2(-0.635,-2.683) 3(0.635,-2.683) 4(1.905,-2.683) 5(1.905,2.683) 6(0.635,2.683) 7(-0.635,2.683) 8(-1.905,2.683)
SOT-23-3_L3.0-W1.7-P0.95-LS2.9-BR
  rect 1.038x0.532 smd: 1(1.101,-0.95) 2(1.101,0.95) 3(-1.101,0)
SOT-223-4_L6.5-W3.5-P2.30-LS7.0-BR
  rect 2.47x0.98 smd: 1(2.835,-2.3) 2(2.835,0) 3(2.835,2.3)
  rect 2.47x3.6 smd: 4(-2.835,0)
SW-SMD_4P-L6.0-W6.0-P4.50-LS9.0-2
  rect 2.3x1.5 smd: 1(-4.55,2.25) 2(4.55,2.25) 3(-4.55,-2.25) 4(4.55,-2.25)
SW-TH_SK-12E12-G5
  round 1.524 hole 1: 1(0,3.175) 2(0,0.127) 3(0,-2.921)
  round 2.2 hole 1.5: 4(0,-6.477) 5(0,6.477)
USB-C-SMD_TYPE-C16PIN
  oval 1x2.1 hole 0.6x1.7: 1(-4.32,1.788) 2(4.32,1.788)
  oval 1x1.8 hole 0.6x1.4: 3(-4.32,-2.362) 4(4.32,-2.362)
  rect 0.6x1.15 smd: A1B12(-3.2,2.362) A4B9(-2.4,2.362) B1A12(3.2,2.362) B4A9(2.4,2.362)
  rect 0.3x1.15 smd: A5(-1.25,2.362) A6(-0.25,2.362) A7(0.25,2.362) A8(-1.75,2.362) B5(1.75,2.362) B6(0.75,2.362) B7(-0.75,2.362) B8(1.25,2.362)

## Nets
As in the schematic.

Pads without a net: SW1 1; TP1 1; TP2 1; TP3 1; TP4 1; U2 2 18 19 20 29 32 33 35 42 43 45 46; U3 4; USB1 A8 B8

## Via types
v1: diameter 0.61, hole 0.305, Top Layer to Bottom Layer, 188 vias

## Routing (per net, layer and track width the routed paths; a pad name or vN(x,y) marks a point on that pad's centre or on a via; arc(x,y) is an arc through that point)
3V3: length 300.4
  Top Layer w0.254: U2.9 34.88,26.75 34.54,26.42 34.54,24.3 C9.2 ; C10.1 44.52,23.93 44.45,24 U2.24 ; 35.43,36.47 36.93,36.47 37.25,36.16 U2.48 ; 35.43,36.47 34.44,36.47 34.04,36.07 34.04,30.86 34.15,30.75 U2.1 ; 35.43,36.47 35.43,37.59 35.42,37.6 C7.2
  Top Layer w0.508: 19.69,35.81 20.27,36.4 20.27,38.19 ; 19.69,35.81 18.47,35.81 ; 19.69,35.81 23.75,35.81 24.76,34.8 24.76,25.27 23.62,24.13 19.94,24.13 18.92,23.11 18.92,16.76 ; v1(37.47,53.21) 37.26,53.01 C13.1 37.26,50.42 ; H1.2 57.76,35.05 54.61,35.05 ; 54.32,53.21 53.21,54.32 53.21,65.02 54.3,66.11 LCD1.1 ; 54.32,53.21 53.76,53.21 53.72,53.17 ; 54.32,53.21 56.9,53.21 57.51,52.6 57.51,40.62 57.15,40.26 55.75,40.26 54.61,39.11 54.61,35.05 ; R11.2 3.65,18.51 4.5,19.36 R17.2 11.43,19.31 11.43,16.89 11.81,16.51 R12.2 ; C7.2 35.33,38.63 C8.1 28.48,40.73 27.94,41.28 27.94,45.67 27.82,45.79 ; 27.82,45.79 30.91,45.79 ; 27.82,45.79 24.46,45.79 23.24,44.58 21.48,44.58 21.46,44.61 C6.1 ; 27.82,45.79 27.82,51.44 28.96,52.58 32.51,52.58 33.13,51.96 R8.1 37.22,50.46 37.26,50.42 ; C10.1 v1(44.76,22.48) ; U3.8 15.16,34.13 C11.1 13.62,37.5 14.32,38.19 20.27,38.19 ; 18.47,35.81 18.47,34.44 18.97,33.93 U3.5 ; 18.47,35.81 18.34,35.94 C12.2 ; 53.72,53.17 47.16,53.17 v1(47.12,53.21) ; 53.72,53.17 BUZZER1.1 ; 20.27,38.19 C6.1 ; C6.1 C5.2 16.74,44.61 15.72,45.62 13.71,45.62 U1.2 ; C9.2 v1(35.43,24.02) 35.43,19.56 34.04,18.16 34.04,16.61 R13.2 30.42,16.58 29.72,15.88 29.72,9.69 29.08,9.06 R15.2 30.28,7.99 30.8,8.51 44.18,8.51 R16.2 44.7,15.62 45.66,16.58 R14.2 49.38,17.88 50.42,18.92 50.42,22.1 v1(50.93,22.61) 50.93,34.04 51.94,35.05 54.61,35.05 ; 37.26,50.42 37.26,49.05 U4.8 U4.7
  Bottom Layer w0.508: v1(50.93,22.61) 50.8,22.48 v1(44.76,22.48) ; v1(47.12,53.21) v1(37.47,53.21)
+5V: length 8.2
  Top Layer w0.508: SW1.3 11.33,51.21 U1.3
GND: length 148.2
  Top Layer w0.254: U2.23 42.25,23.03 v1(42.93,22.35) ; v1(37.85,33.66) 37.75,33.56 U2.47 ; v1(33.97,27.24) 35.99,27.24 U2.8
  Top Layer w0.508: v1(24.76,18.54) v1(27.24,18.54) v1(29.73,18.54) v1(32.41,18.54) 32.77,18.89 v1(32.77,21.31) v1(32.77,24.2) v1(32.77,26.03) v1(33.97,27.24) ; v1(24.76,18.54) v1(24.76,22.35) 25.14,22.73 C23.1 28.16,22.73 28.4,22.49 v1(28.4,26.62) v1(29.18,27.4) 29.96,28.18 v1(29.96,29.01) C21.1 v1(28.22,30.53) v1(26.74,30.53) v1(25.65,31.62) v1(25.65,33.56) v1(25.65,34.97) v1(25.65,36.83) v1(26.19,37.36) v1(28.1,37.36) C20.1 v1(31.76,37.36) 32.36,37.36 v1(33.15,36.58) v1(33.15,33.37) v1(33.15,30.99) ; v1(24.76,18.54) 25.27,18.03 25.27,16.56 C15.1 ; 26.63,14.46 v1(28.41,14.46) ; 39.34,50.55 v1(41.12,50.55) ; H1.1 v1(56.01,37.62) ; KEY1.1 v1(2.12,12.68) ; KEY1.2 v1(13,14.46) ; C5.1 v1(18.2,48.39) ; 7.45,53.41 v1(7.45,55.2) ; 17.53,14.46 v1(15.75,14.46) ; 46.84,23.93 v1(48.62,23.93) ; 32.94,14.67 v1(32.94,12.89) ; v1(26.37,5.44) 26.37,6.84 26.24,6.97 ; 3.21,24.12 v1(1.43,24.12) ; 39.31,36.51 v1(39.31,38.29) ; v1(39.19,40.73) 37.4,40.73 37.42,40.72 C7.1 ; 13.41,19.22 v1(13.41,17.57) ; LCD1.2 v1(54.22,68.65) ; 3,36.16 v1(1.22,36.16) ; 42.15,6.97 v1(42.15,5.19) ; KEY4.1 v1(46.57,14.46) ; 30.91,44.52 v1(29.13,44.52) ; C2.2 9.38,42.95 9.45,42.88 ; 17.52,6.97 v1(15.74,6.97) ; 9.45,43.21 9.45,42.88 ; 9.45,42.88 v1(9.45,41.43) ; C12.1 v1(16.27,34.42) ; KEY3.2 v1(42.04,12.68) ; U1.1 v1(16.01,53.07) ; 40.1,16.64 v1(41.88,16.64) ; 55.71,16.66 v1(57.49,16.66) ; KEY6.1 v1(31.27,6.97) ; 29.14,4 v1(27.35,4) ; 34.26,21.94 v1(34.26,20.16) ; Q1.2 v1(55.37,41.07) ; 51.46,44.9 v1(51.46,46.68) ; v1(11.62,37.57) C11.2 ; C6.2 v1(20.27,48.39) ; 9.59,53.41 v1(9.59,55.2) ; C14.1 v1(9.76,18.29) ; C19.1 v1(43.15,3.71) ; USB1.B1A12 v1(8.76,26.8) ; KEY7.1 v1(1.26,23.12) ; KEY4.2 v1(59.23,14.46)
  Bottom Layer w0.254: v1(47.12,20.45) 43.43,20.45 42.93,20.96 v1(42.93,22.35)
  Bottom Layer w0.508: v1(30.6,20.74) 32.2,20.74 v1(32.77,21.31)
  vias: v1(2.18,31.14) v1(2.18,30) v1(3.7,31.14) v1(3.68,30) v1(6.86,8.13) v1(6.86,6.99) v1(8.38,8.13) v1(8.35,6.99) v1(10.16,25.53) v1(10.16,24.38) v1(11.68,25.53) v1(11.66,24.38) v1(11.94,7.87) v1(11.94,6.73) v1(12.57,41.4) v1(12.57,40.26) v1(13.43,6.73) v1(13.46,7.87) v1(14.1,41.4) v1(14.07,40.26) v1(15.24,24.76) v1(15.24,23.62) v1(16.74,23.62) v1(16.76,24.76) v1(16.89,41.15) v1(16.89,40) v1(18.41,41.15) v1(18.39,40) v1(20.07,54.36) v1(20.07,53.21) v1(21.46,21.21) v1(21.46,20.07) v1(21.59,54.36) v1(21.56,53.21) v1(22.61,50.55) v1(22.61,49.4) v1(22.99,21.21) v1(22.96,20.07) v1(23.5,41.28) v1(23.5,40.13) v1(24.13,50.55) v1(24.1,49.4) v1(24.26,54.36) v1(24.26,53.21) v1(25.02,41.28) v1(24.99,40.13) v1(25.78,54.36) v1(25.75,53.21) v1(32.89,55.63) v1(32.89,54.48) v1(34.42,55.63) v1(34.39,54.48) v1(37.59,43.43) v1(37.59,42.29) v1(39.12,43.43) v1(39.09,42.29) v1(43.43,18.41) v1(43.43,17.27) v1(44.93,17.27) v1(44.96,18.41) v1(46.86,49.02) v1(46.86,47.88) v1(48.39,49.02) v1(48.36,47.88) v1(48.77,6.35) v1(48.77,5.21) v1(49.4,67.94) v1(49.4,66.8) v1(50.29,6.35) v1(50.26,5.21) v1(50.93,67.94) v1(50.9,66.8) v1(51.18,40.64) v1(51.18,39.5) v1(52.71,40.64) v1(52.68,39.5) v1(54.1,22.73) v1(54.1,21.59) v1(55.63,22.73) v1(55.6,21.59) v1(57.02,20.07) v1(57.02,18.92) v1(58.55,20.07) v1(58.52,18.92)
VBUS: length 28.1
  Top Layer w0.508: 7.38,45.36 7.37,45.37 7.37,47.62 6.83,48.16 SW1.2 ; 7.38,45.36 C2.1 ; 7.38,45.36 7.38,40.25 8.89,38.73 v1(8.89,32.39) 7.38,32.39 USB1.A4B9 ; USB1.B4A9 v1(8.89,27.6)
  Bottom Layer w0.508: v1(8.89,27.6) v1(8.89,32.39)
BOOT0: length 2.5
  Top Layer w0.254: R3.2 39.25,34.37 U2.44
BUZZER: length 18.4
  Top Layer w0.254: R9.2 46.8,44.77 v1(46.74,44.7) ; U2.36 45.23,30.75 45.72,31.24 v1(45.72,32.13)
  Bottom Layer w0.254: v1(45.72,32.13) 45.72,43.69 v1(46.74,44.7)
CC1: length 6.9
  Top Layer w0.254: R1.1 5.08,31.75 5.59,31.24 6.53,31.24 6.53,31.25 USB1.A5
CC2: length 5.9
  Top Layer w0.254: R2.1 5.29,27.77 5.77,28.25 USB1.B5
KEY_A: length 44.3
  Top Layer w0.254: U2.14 37.75,19.08 v1(36.96,18.29) ; KEY5.3 KEY5.4 26.99,1.93 C18.2 30.14,1.93 30.48,2.26 v1(30.48,4.32) 30.48,5.46 29.96,5.99 R15.1
  Bottom Layer w0.254: v1(36.96,18.29) 36.96,5.21 36.07,4.32 v1(30.48,4.32)
KEY_B: length 40.3
  Top Layer w0.254: U2.15 38.25,18.9 v1(38.74,18.41) ; 38.71,2.47 KEY6.4 43,2.47 43.76,1.71 C19.2 45.83,1.71 46.03,1.91 46.03,5.66 45.7,5.99 R16.1 ; 38.71,2.47 38.74,2.49 v1(38.74,2.54) ; 38.71,2.47 KEY6.3
  Bottom Layer w0.254: v1(38.74,18.41) v1(38.74,2.54)
KEY_DOWN: length 53.9
  Top Layer w0.254: 20.92,9.96 23.34,9.96 ; 20.92,9.96 21.04,10.08 R12.1 ; 20.92,9.96 17.53,9.96 ; 23.34,9.96 28.51,9.96 v1(28.57,10.03) ; 23.34,9.96 23.22,10.07 C15.2 ; U2.11 37.69,25.75 v1(37.85,25.91)
  Bottom Layer w0.254: v1(37.85,25.91) 39.37,25.91 39.5,25.78 39.5,21.21 39.12,20.83 36.32,20.83 36.14,20.65 36.14,10.62 35.56,10.03 v1(28.57,10.03)
KEY_LEFT: length 31.3
  Top Layer w0.254: 37.99,9.96 KEY3.4 ; 37.99,9.96 35.9,9.96 ; 37.99,9.96 38.02,10 C16.2 ; 35.9,9.96 36,10.07 R13.1 36.19,16.77 36.19,25.06 U2.12 ; 35.9,9.96 KEY3.3
KEY_RIGHT: length 44.3
  Top Layer w0.254: 53.68,9.96 53.63,10.02 C17.2 ; 53.68,9.96 51.46,9.96 ; 53.68,9.96 KEY4.4 ; U2.13 37.25,20.23 v1(36.83,19.81) ; 51.46,9.96 51.38,10.05 R14.1 51.38,19.24 v1(51.31,19.3) ; 51.46,9.96 KEY4.3
  Bottom Layer w0.254: v1(51.31,19.3) 50.8,19.81 v1(36.83,19.81)
KEY_UP: length 65.7
  Top Layer w0.254: 7.85,9.96 7.76,10.05 C14.2 ; 7.85,9.96 5.61,9.96 ; 7.85,9.96 KEY1.4 13.65,9.96 v1(13.72,10.03) ; 5.61,9.96 5.65,10.01 R11.1 ; 5.61,9.96 KEY1.3 ; v1(37.72,26.8) 37.17,26.25 U2.10
  Bottom Layer w0.254: v1(13.72,10.03) 14.6,10.92 34.8,10.92 35.56,11.68 35.56,21.08 35.81,21.34 36.7,21.34 37.08,21.72 37.08,26.16 v1(37.72,26.8)
LCD_BLK: length 85.9
  Top Layer w0.254: v1(49.4,76.07) 46.1,76.07 45.47,75.44 45.47,40.77 46.08,40.16 48.07,40.16 49.68,38.55 49.68,21.74 49.15,21.21 41.66,21.21 41.25,21.62 U2.21
  Bottom Layer w0.254: LCD1.8 55.93,83.82 50.16,83.82 49.4,83.06 v1(49.4,76.07)
LCD_CS: length 71.8
  Top Layer w0.254: U2.25 48.36,25.25 48.77,25.65 48.77,38.17 47.7,39.24 45.7,39.24 44.55,40.39 44.55,76.94 45.21,77.6 51.82,77.6 52.45,76.96 v1(52.45,76.33)
  Bottom Layer w0.254: LCD1.5 55.94,76.33 v1(52.45,76.33)
LCD_DC: length 71
  Top Layer w0.254: U2.27 47.5,26.25 47.88,26.63 47.88,37.8 47.33,38.35 45.33,38.35 43.66,40.02 43.66,78.08 44.39,78.81 LCD1.6
LCD_MOSI: length 64.9
  Top Layer w0.254: U2.28 47.12,26.75 47.37,27 47.37,37.59 47.12,37.85 45.12,37.85 43.15,39.81 43.15,69.88 v1(42.04,70.99)
  Bottom Layer w0.254: LCD1.3 55.8,70.99 v1(42.04,70.99)
LCD_RES: length 91.9
  Top Layer w0.254: U2.22 41.75,22.26 42.29,21.72 48.77,21.72 49.28,22.22 49.28,38.38 47.91,39.75 45.91,39.75 45.06,40.6 45.06,76.17 45.85,76.96 50.8,76.96 51.56,76.2 51.56,73.28 52.19,72.65 56.9,72.65 57.08,72.83 57.08,81.1 56.83,81.35 LCD1.7
LCD_SCK: length 74.9
  Top Layer w0.254: LCD1.4 54.41,73.73 54.1,74.04 54.1,77.72 53.72,78.11 44.58,78.11 44.15,77.67 44.15,40.22 45.53,38.84 47.53,38.84 48.36,38 48.36,26.23 47.88,25.75 U2.26
NRST: length 42
  Top Layer w0.254: KEY7.2 13.38,21.34 C24.2 13.84,21.3 13.87,21.34 v1(15.75,21.34) ; U2.7 v1(37.85,27.75)
  Bottom Layer w0.254: 37.13,27.04 36.7,26.61 36.7,26.36 36.68,26.33 36.68,22.77 35.15,21.25 35.15,18.52 34.29,17.65 16.26,17.65 15.75,18.16 v1(15.75,21.34) ; 37.48,27.38 37.13,27.04 ; v1(37.85,27.75) 37.48,27.38
PA6: length 23.8
  Top Layer w0.254: R6.1 23.79,30.96 v1(23.82,30.99) ; v1(37.85,30.23) 38.35,30.23 38.75,29.83 U2.16
  Bottom Layer w0.254: v1(37.85,30.23) 32.51,30.23 30.35,32.39 24.89,32.39 23.82,31.32 v1(23.82,30.99)
PA7: length 23.1
  Top Layer w0.254: R7.1 23.47,28.8 23.5,28.83 v1(23.75,28.83) ; U2.17 39.25,29.34 v1(39.37,29.46)
  Bottom Layer w0.254: v1(23.75,28.83) 27.81,28.83 29.21,30.23 31.62,30.23 32.38,29.46 v1(39.37,29.46)
PA9: length 16
  Top Layer w0.254: U2.30 45.91,27.75 v1(46.23,27.43)
  Bottom Layer w0.254: H1.6 57.76,24.89 55.88,24.89 55.63,25.15 55.63,26.92 55.12,27.43 v1(46.23,27.43)
PA10: length 14.1
  Top Layer w0.254: U2.31 v1(46.35,28.25)
  Bottom Layer w0.254: H1.5 55.98,27.46 55.19,28.25 v1(46.35,28.25)
PA13: length 13.9
  Top Layer w0.254: U2.34 v1(46.35,29.75)
  Bottom Layer w0.254: H1.4 57.76,29.97 55.5,29.97 55.28,29.75 v1(46.35,29.75)
PA14: length 23
  Top Layer w0.254: U2.37 42.75,35.77 43.69,36.7 v1(46.35,36.7)
  Bottom Layer w0.254: v1(46.35,36.7) 54.99,36.7 55.37,36.32 55.37,32.89 55.75,32.51 57.76,32.51 H1.3
PA15: length 28.7
  Top Layer w0.254: U2.38 42.25,46.27 v1(41.53,46.99) ; R8.2 31.13,48.55 30.91,48.33 33.58,48.33 v1(33.66,48.26)
  Bottom Layer w0.254: v1(33.66,48.26) 34.29,47.62 40.89,47.62 v1(41.53,46.99)
PB3: length 17.3
  Top Layer w0.254: U4.6 39.35,45.79 39.41,45.85 41.15,45.85 41.75,45.25 U2.39
PB4: length 24.7
  Top Layer w0.254: U2.40 41.25,44.47 v1(40.64,45.08) ; v1(33.27,46.99) 33.2,47.06 30.91,47.06
  Bottom Layer w0.254: v1(33.27,46.99) 33.27,45.59 33.78,45.08 v1(40.64,45.08)
PB5: length 15
  Top Layer w0.254: U2.41 40.75,43.96 40.19,44.52 U4.5
PC14-OSC32_IN: length 13.8
  Top Layer w0.254: U2.3 32.99,29.75 32.26,30.48 32.26,35.11 32,35.36 C20.2 29.02,35.36 29.02,35.37 X1.2
PC15-OSC32_OUT: length 11.6
  Top Layer w0.254: X1.1 29.62,32.87 C21.2 31.24,32.53 31.5,32.28 31.5,29.97 32.22,29.25 U2.4
PF0-OSC_IN: length 11.3
  Top Layer w0.254: U2.5 33.83,28.75 33.4,28.32 30.99,28.32 30.47,27.81 C22.2 30.47,22.62 30.6,22.49
PF1-OSC_OUT: length 18
  Top Layer w0.254: U2.6 33.9,28.25 31.75,26.1 31.75,19.94 31.37,19.56 28.7,19.56 28.4,19.86 28.4,20.74 28.39,20.73 C23.2
UD+: length 6.6
  Top Layer w0.254: R5.2 10.2,29.05 10,29.25 USB1.B6 6.56,29.25 6.35,29.46 6.35,30.1 6.53,30.28 7.33,30.28 USB1.A6
UD-: length 5.8
  Top Layer w0.254: USB1.B7 8.1,30.75 ; 8.1,30.75 9.67,30.75 10.26,31.34 R4.2 ; 8.1,30.75 8.24,30.61 8.24,29.96 8.06,29.78 7.39,29.78 USB1.A7
$1N8057: length 4.2
  Top Layer w0.254: R9.1 53.39,42.77 Q1.1
$1N8058: length 3.1
  Top Layer w0.254: BUZZER1.2 54.42,48.1 Q1.3
$1N34821: length 4
  Top Layer w0.254: R5.1 14.76,29.05 15.11,28.7 15.11,27.04 U3.1
$1N34825: length 6.9
  Top Layer w0.254: 16.43,26.99 16.43,29.03 16,29.46 15.11,29.46 14.6,29.97 14.6,30.86 14.13,31.34 R4.1
$1N34844: length 7.6
  Top Layer w0.254: R7.2 20.5,28.65 19.92,28.65 19.74,28.83 19.74,29.79 19.56,29.97 16.76,29.97 16.43,30.3 16.43,32.36
$1N34851: length 4.2
  Top Layer w0.254: U3.6 17.7,31.16 17.91,30.96 R6.2

## Copper pours and planes (outline as drawn; the poured copper is in the pictures)
GND on Top Layer: 0.13,100.33 60.58,100.33 60.58,-0.25 0.13,-0.25
GND on Bottom Layer: -1.52,101.47 61.98,101.47 61.98,-1.65 -1.52,-1.65

Small or netless copper shapes (teardrops, artwork), in the pictures only: 376 on Top Layer, 46 on Bottom Layer
